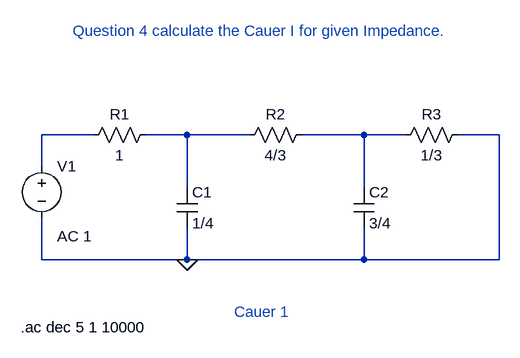
[diagram p0: schematic 4_Dheerendra_23EE019_AC_Network_synthesis.asc]
4_Dheerendra_23EE019_AC_Network_synthesis.asc, the LTspice schematic file:
Version 4
SHEET 1 880 680
WIRE 48 256 -32 256
WIRE 192 256 128 256
WIRE 288 256 192 256
WIRE 464 256 368 256
WIRE 528 256 464 256
WIRE 672 256 608 256
WIRE -32 304 -32 256
WIRE 192 336 192 256
WIRE 464 336 464 256
WIRE -32 448 -32 384
WIRE 192 448 192 400
WIRE 192 448 -32 448
WIRE 464 448 464 400
WIRE 464 448 192 448
WIRE 672 448 672 256
WIRE 672 448 464 448
FLAG 192 448 0
SYMBOL res 144 240 R90
WINDOW 0 0 56 VBottom 2
WINDOW 3 32 56 VTop 2
SYMATTR InstName R1
SYMATTR Value 1
SYMBOL res 384 240 R90
WINDOW 0 0 56 VBottom 2
WINDOW 3 32 56 VTop 2
SYMATTR InstName R2
SYMATTR Value 4/3
SYMBOL res 624 240 R90
WINDOW 0 0 56 VBottom 2
WINDOW 3 32 56 VTop 2
SYMATTR InstName R3
SYMATTR Value 1/3
SYMBOL cap 176 336 R0
SYMATTR InstName C1
SYMATTR Value 1/4
SYMBOL cap 448 336 R0
SYMATTR InstName C2
SYMATTR Value 3/4
SYMBOL voltage -32 288 R0
WINDOW 123 24 124 Left 2
WINDOW 39 0 0 Left 0
SYMATTR InstName V1
SYMATTR Value ""
SYMATTR Value2 AC 1
TEXT 16 96 Left 2 ;Question 4 calculate the Cauer I for given Impedance.
TEXT 264 528 Left 2 ;Cauer 1
TEXT -64 552 Left 2 !.ac dec 5 1 10000

The netlist it stands for:
* 4_Dheerendra_23EE019_AC_Network_synthesis.asc
R1 N002 N001 1
R2 N003 N002 4/3
R3 0 N003 1/3
C1 N002 0 1/4
C2 N003 0 3/4
V1 N001 0 AC 1
* Question 4 calculate the Cauer I for given Impedance.
* Cauer 1
.ac dec 5 1 10000
.backanno
.end